# EAGLE schematic cansat (EAGLE 7.3.0)
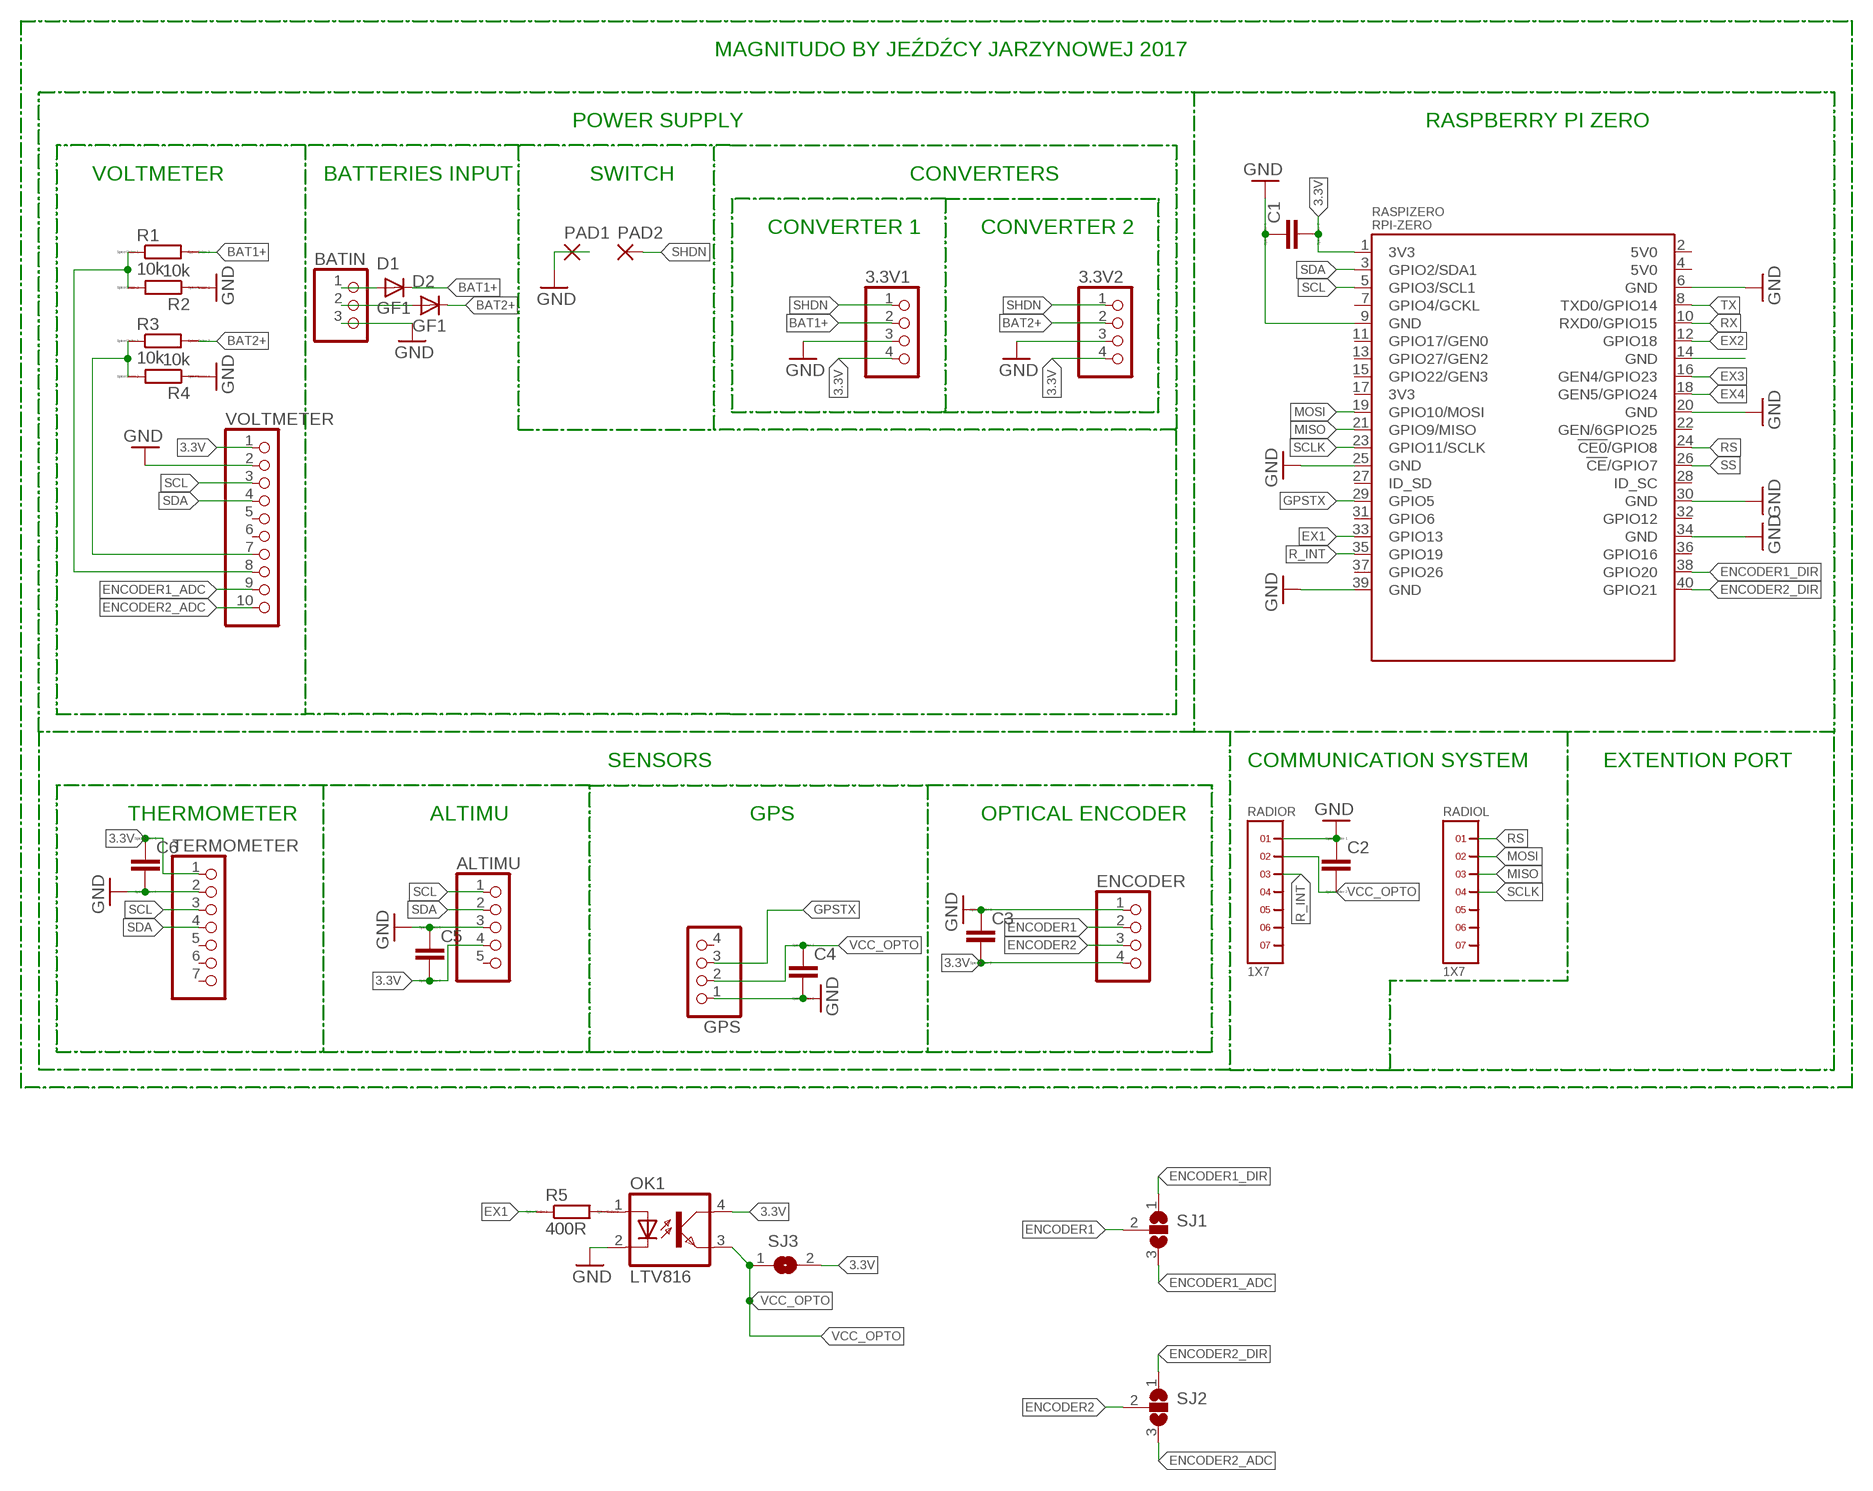
[diagram p0: schematic, sheet 1]

## Parts
3.3V1  PINHD-1X4  [1X04]
3.3V2  PINHD-1X4  [1X04]
ALTIMU  PINHD-1X5  [1X05]
BATIN  PINHD-1X3  [1X03]
C1  CC1206  [C1206]
C2  CC1206  [C1206]
C3  CC1206  [C1206]
C4  CC1206  [C1206]
C5  CC1206  [C1206]
C6  CC1206  [C1206]
D1  GF1  [SMA-DO214AC]
D2  GF1  [SMA-DO214AC]
ENCODER  PINHD-1X4  [1X04]
GPS  PINHD-1X4  [1X04]
OK1  LTV816  [DIL04]
PAD1  WIREPADSMD5-2,5  [5-2,5]
PAD2  WIREPADSMD5-2,5  [5-2,5]
R1  10k  RR1206  [R1206]
R2  10k  RR1206  [R1206]
R3  10k  RR1206  [R1206]
R4  10k  RR1206  [R1206]
R5  400R  RR1206  [R1206]
RADIOL  1X7  [1X7]
RADIOR  1X7  [1X7]
RASPIZERO  RPI-ZERO  [RASPBERRYPI_BASTELSTUBE_V13_RASPI_BOARD_B+_FULL]
SJ1  SJ2W  [SJ_2]
SJ2  SJ2W  [SJ_2]
SJ3  SJ  [SJ]
TERMOMETER  PINHD-1X7  [1X07]
VOLTMETER  PINHD-1X10  [1X10]

## Nets
3.3V: 3.3V1.4 3.3V2.4 ALTIMU.4 C1.2 C3.2 C5.2 C6.1 ENCODER.4 OK1.4(COL) RASPIZERO.1(3V3) SJ3.2 TERMOMETER.1 VOLTMETER.1
BAT1+: 3.3V1.2 D1.K(C) R1.2
BAT2+: 3.3V2.2 D2.K(C) R3.2
ENCODER1: ENCODER.2 SJ1.2
ENCODER1_ADC: SJ1.3 VOLTMETER.9
ENCODER1_DIR: RASPIZERO.38(GPIO20) SJ1.1
ENCODER2: ENCODER.3 SJ2.2
ENCODER2_ADC: SJ2.3 VOLTMETER.10
ENCODER2_DIR: RASPIZERO.40(GPIO21) SJ2.1
EX1: R5.1 RASPIZERO.33(GPIO13)
EX2: RASPIZERO.12(GPIO18)
EX3: RASPIZERO.16(GEN4/GPIO23)
EX4: RASPIZERO.18(GEN5/GPIO24)
GND: 3.3V1.3 3.3V2.3 ALTIMU.3 BATIN.3 C1.1 C2.1 C3.1 C4.2 C5.1 C6.2 ENCODER.1 GPS.1 OK1.2(C) PAD1.1(P) R2.1 R4.1 RADIOR.1 RASPIZERO.6(GND) RASPIZERO.9(GND) RASPIZERO.20(GND) RASPIZERO.25(GND) RASPIZERO.30(GND) RASPIZERO.34(GND) RASPIZERO.39(GND) TERMOMETER.2 VOLTMETER.2
GND@4: RASPIZERO.14(GND)
GPSTX: GPS.3 RASPIZERO.29(GPIO5)
MISO: RADIOL.3 RASPIZERO.21(GPIO9/MISO)
MOSI: RADIOL.2 RASPIZERO.19(GPIO10/MOSI)
N$1: R1.1 R2.2 VOLTMETER.8
N$2: OK1.1(A) R5.2
N$9: R3.1 R4.2 VOLTMETER.7
N$10: BATIN.1 D1.A
N$11: BATIN.2 D2.A
R_INT: RADIOR.3 RASPIZERO.35(GPIO19)
RS: RADIOL.1 RASPIZERO.24(!CE0!/GPIO8)
RX: RASPIZERO.10(RXD0/GPIO15)
SCL: ALTIMU.1 RASPIZERO.5(GPIO3/SCL1) TERMOMETER.3 VOLTMETER.3
SCLK: RADIOL.4 RASPIZERO.23(GPIO11/SCLK)
SDA: ALTIMU.2 RASPIZERO.3(GPIO2/SDA1) TERMOMETER.4 VOLTMETER.4
SHDN: 3.3V1.1 3.3V2.1 PAD2.1(P)
SS: RASPIZERO.26(!CE!/GPIO7)
TX: RASPIZERO.8(TXD0/GPIO14)
VCC_OPTO: C2.2 C4.1 GPS.2 OK1.3(EMIT) RADIOR.2 SJ3.1
Unconnected: ALTIMU.5 GPS.4 RADIOL.5 RADIOL.6 RADIOL.7 RADIOR.4 RADIOR.5 RADIOR.6 RADIOR.7 RASPIZERO.2(5V0) RASPIZERO.4(5V0) RASPIZERO.7(GPIO4/GCKL) RASPIZERO.11(GPIO17/GEN0) RASPIZERO.13(GPIO27/GEN2) RASPIZERO.15(GPIO22/GEN3) RASPIZERO.17(3V3) RASPIZERO.22(GEN/6GPIO25) RASPIZERO.27(ID_SD) RASPIZERO.28(ID_SC) RASPIZERO.31(GPIO6) RASPIZERO.32(GPIO12) RASPIZERO.36(GPIO16) RASPIZERO.37(GPIO26) TERMOMETER.5 TERMOMETER.6 TERMOMETER.7 VOLTMETER.5 VOLTMETER.6

## Notes on the sheet
- MAGNITUDO BY JEŹDŹCY JARZYNOWEJ 2017
- POWER SUPPLY | RASPBERRY PI ZERO
- VOLTMETER | BATTERIES INPUT | SWITCH | CONVERTERS
- CONVERTER 1 | CONVERTER 2
- SENSORS | COMMUNICATION SYSTEM | EXTENTION PORT
- THERMOMETER | ALTIMU | GPS | OPTICAL ENCODER

## Library data of the parts
3.3V1 3.3V2 ENCODER GPS = pinhead:PINHD-1X4: PIN HEADER
ALTIMU = pinhead:PINHD-1X5: PIN HEADER
BATIN = pinhead:PINHD-1X3: PIN HEADER
C1-C6 = eagle-ltspice:C: CAPACITOR, European symbol; SPICEMODEL: NONE; SPICEPREFIX: C
D1 D2 = diode:GF1: DIODE
OK1 = optocoupler:LTV816: OPTO COUPLER Source: LITEON, LTV816.pdf; OC_FARNELL: unknown; OC_NEWARK: unknown
PAD1 PAD2 = wirepad:WIREPAD: Wire PAD connect wire on PCB
R1-R5 = eagle-ltspice:R: RESISTOR, European symbol; SPICEMODEL: NONE; SPICEPREFIX: R
RADIOL RADIOR = headers(2mm):1X7
RASPIZERO = RPI-Zero:RPI-ZERO
SJ1 SJ2 = jumper:SJ2W: SMD solder JUMPER
SJ3 = jumper:SJ: SMD solder JUMPER
TERMOMETER = pinhead:PINHD-1X7: PIN HEADER
VOLTMETER = pinhead:PINHD-1X10: PIN HEADER